# EAGLE schematic dispositivos-i2c (EAGLE 9.1.2)
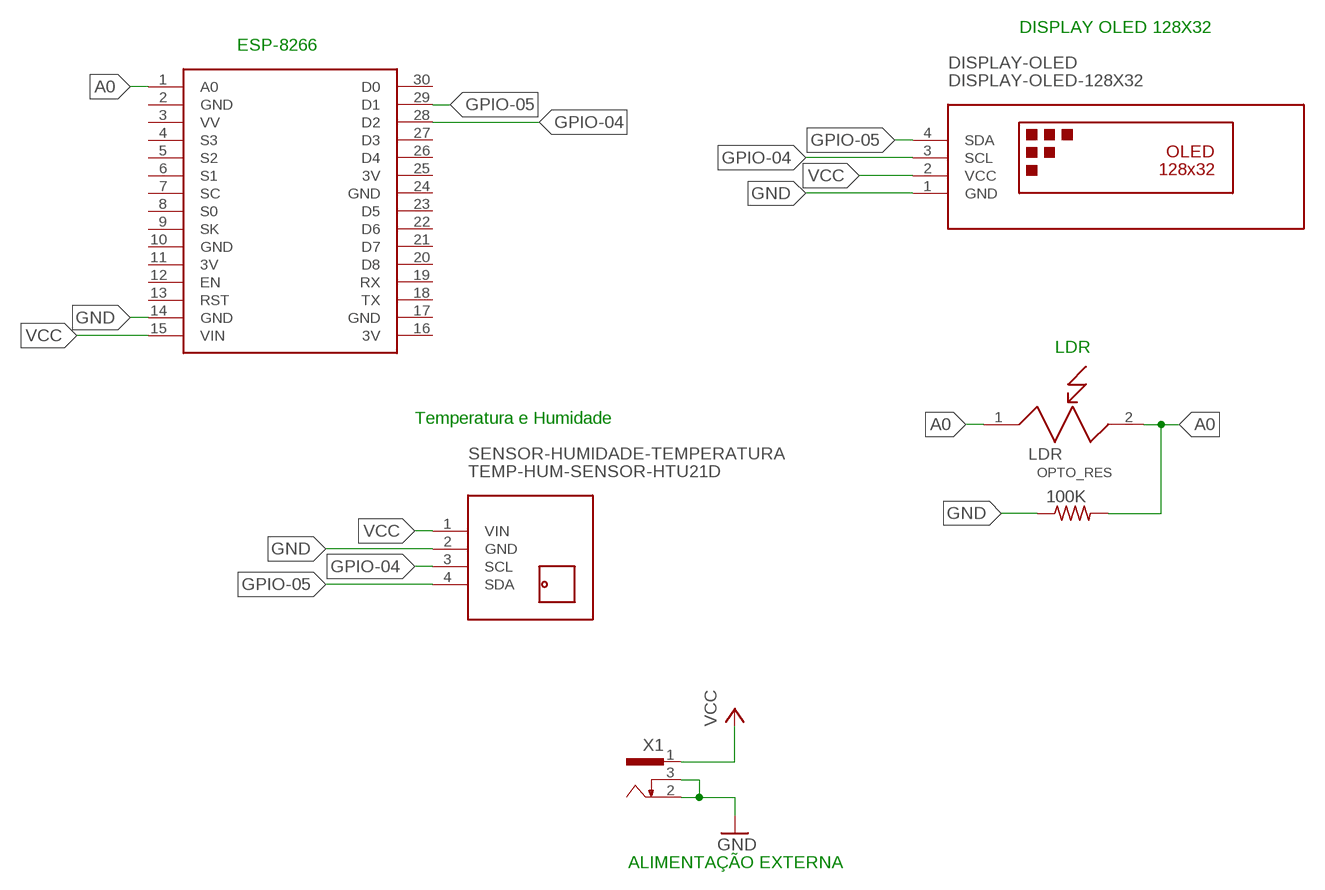
[diagram p0: schematic, sheet 1]

## Parts
100K  R-US_0204/2V  [0204V]
DISPLAY-OLED  DISPLAY-OLED-128X32  [DISPLAY-OLED-128X32]
ESP-8266  NODEMCU  [NODEMCU]
LDR  OPTO_RES  [OPTO_RES]
SENSOR-HUMIDADE-TEMPERATURA  TEMP-HUM-SENSOR-HTU21D  [TEMP-HUM-SENSOR-HTU21D]
X1  SCD-014A  [SCD-014-A]

## Nets
A0: 100K.2 ESP-8266.1(A0) LDR.1 LDR.2
GND: 100K.1 DISPLAY-OLED.1(GND) ESP-8266.14(GND) SENSOR-HUMIDADE-TEMPERATURA.2(GND) X1.2 X1.3
GPIO-04: DISPLAY-OLED.3(SCL) ESP-8266.28(D2) SENSOR-HUMIDADE-TEMPERATURA.3(SCL)
GPIO-05: DISPLAY-OLED.4(SDA) ESP-8266.29(D1) SENSOR-HUMIDADE-TEMPERATURA.4(SDA)
VCC: DISPLAY-OLED.2(VCC) ESP-8266.15(VIN) SENSOR-HUMIDADE-TEMPERATURA.1(VIN) X1.1
Unconnected: ESP-8266.3(VV) ESP-8266.4(S3) ESP-8266.5(S2) ESP-8266.6(S1) ESP-8266.7(SC) ESP-8266.8(S0) ESP-8266.9(SK) ESP-8266.12(EN) ESP-8266.13(RST) ESP-8266.18(TX) ESP-8266.19(RX) ESP-8266.20(D8) ESP-8266.21(D7) ESP-8266.22(D6) ESP-8266.23(D5) ESP-8266.26(D4) ESP-8266.27(D3) ESP-8266.30(D0)

## Notes on the sheet
- DISPLAY OLED 128X32
- ESP-8266
- LDR
- Temperatura e Humidade
- ALIMENTAÇÃO EXTERNA

## Power pins joined to a net without a drawn wire
3V: ESP-8266.11(3V) ESP-8266.16(3V) ESP-8266.25(3V)
GND: ESP-8266.2(GND) ESP-8266.10(GND) ESP-8266.17(GND) ESP-8266.24(GND)

## Library data of the parts
100K = resistor:R-US_: RESISTOR, American symbol
DISPLAY-OLED = diy-modules:DISPLAY-OLED-128X32: 128x32 Dot Matrix OLED Module with I2C interface based on SSD1306 chip More details available here: http://www.tinyosshop.com/index.php?route=product/product&product_id=953 Schematic available here: http://www.tinyosshop.com/datasheet/OLED%2012832.pdf SSD1306 datasheet: https://cdn-shop.adafruit.com/datasheets/SSD1306.pdf Click here to find device on ebay.com <http://www.ebay.com/sch/oled+display+128x32+i2c>
ESP-8266 = nodemcu:NODEMCU
LDR = opto-resistor:OPTO_RES
SENSOR-HUMIDADE-TEMPERATURA = diy-modules:TEMP-HUM-SENSOR-HTU21D: Digital Humidity & Temperature Sensor based on HTU21D device More information about HTU21D device is available here: http://futureeverything.org/wp-content/uploads/2014/05/Humidity-Datasheet.pdf HTU21D Arudino Library is available here: https://learn.sparkfun.com/tutorials/htu21d-humidity-sensor-hookup-guide/htu21d-library-and-functions Click here to find device on ebay.com <http://www.ebay.com/sch/htu21d+board>
X1 = con-shiua-chyuan:SCD-014A: Power Jack 2.5mm; OC_FARNELL: unknown; OC_NEWARK: unknown